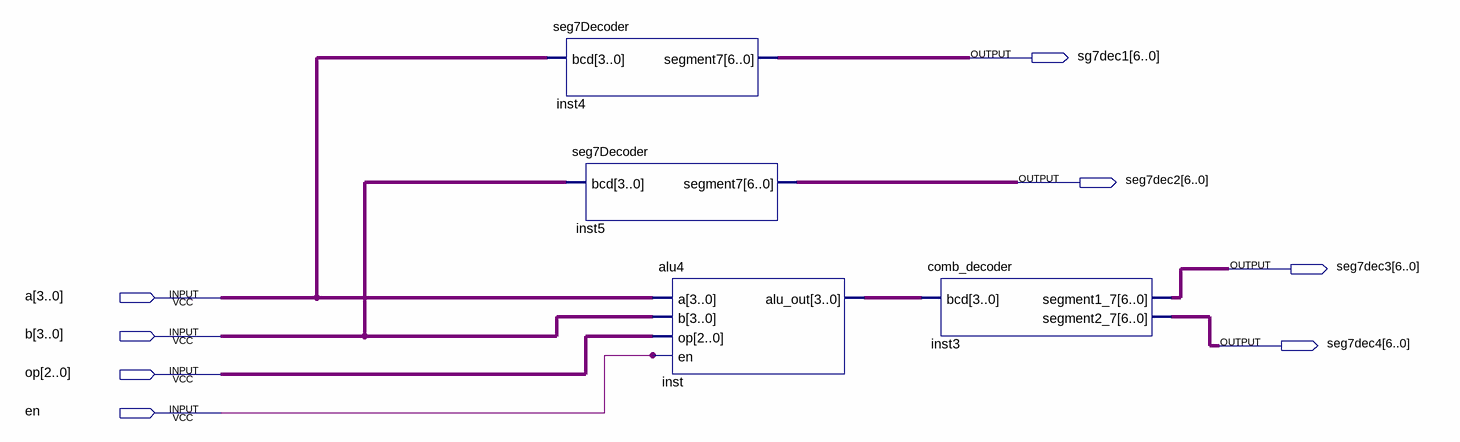
[diagram p0: schematic sheet]
// Quartus schematic combined.bdf as structural Verilog: 4 symbols, 8 pins
module combined (
  input  [3:0] a,
  input  [3:0] b,
  input  [2:0] op,
  input  en,
  output [6:0] sg7dec1,
  output [6:0] seg7dec2,
  output [6:0] seg7dec3,
  output [6:0] seg7dec4
);

  wire [3:0] inst_alu_out;

  seg7Decoder inst4 (.bcd(a), .segment7(sg7dec1));
  seg7Decoder inst5 (.bcd(b), .segment7(seg7dec2));
  alu4 inst (.a(a), .b(b), .op(op), .en(en), .alu_out(inst_alu_out));
  comb_decoder inst3 (.bcd(inst_alu_out), .segment1_7(seg7dec3), .segment2_7(seg7dec4));
endmodule
